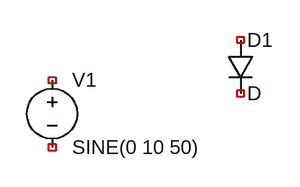
[diagram p0: schematic diodes.asc]
diodes.asc, the LTspice schematic file:
Version 4
SHEET 1 880 680
SYMBOL voltage 144 144 R0
WINDOW 123 0 0 Left 2
WINDOW 39 0 0 Left 2
SYMATTR InstName V1
SYMATTR Value SINE(0 10 50)
SYMBOL diode 352 112 R0
SYMATTR InstName D1

The netlist it stands for:
* diodes.asc
V1 NC_01 NC_02 SINE(0 10 50)
D1 NC_03 NC_04 D
.model D D
.lib standard.dio
.backanno
.end